# Altium schematic sheet USB_to_UART.SchDoc
size A3; ApprovedBy: Mustafa Atılay Beycan; CheckedBy: Mustafa Atılay Beycan; Author: Mustafa Atılay Beycan; CompanyName: Mustafa Atılay Beycan; DrawnBy: Mustafa Atılay Beycan; Engineer: Mustafa Atılay Beycan; Organization: Mustafa Atılay Beycan; SheetNumber: 5; SheetTotal: 8; FilePath: https://github.com/mustafaatilay/Outdoor-Tracking-Project
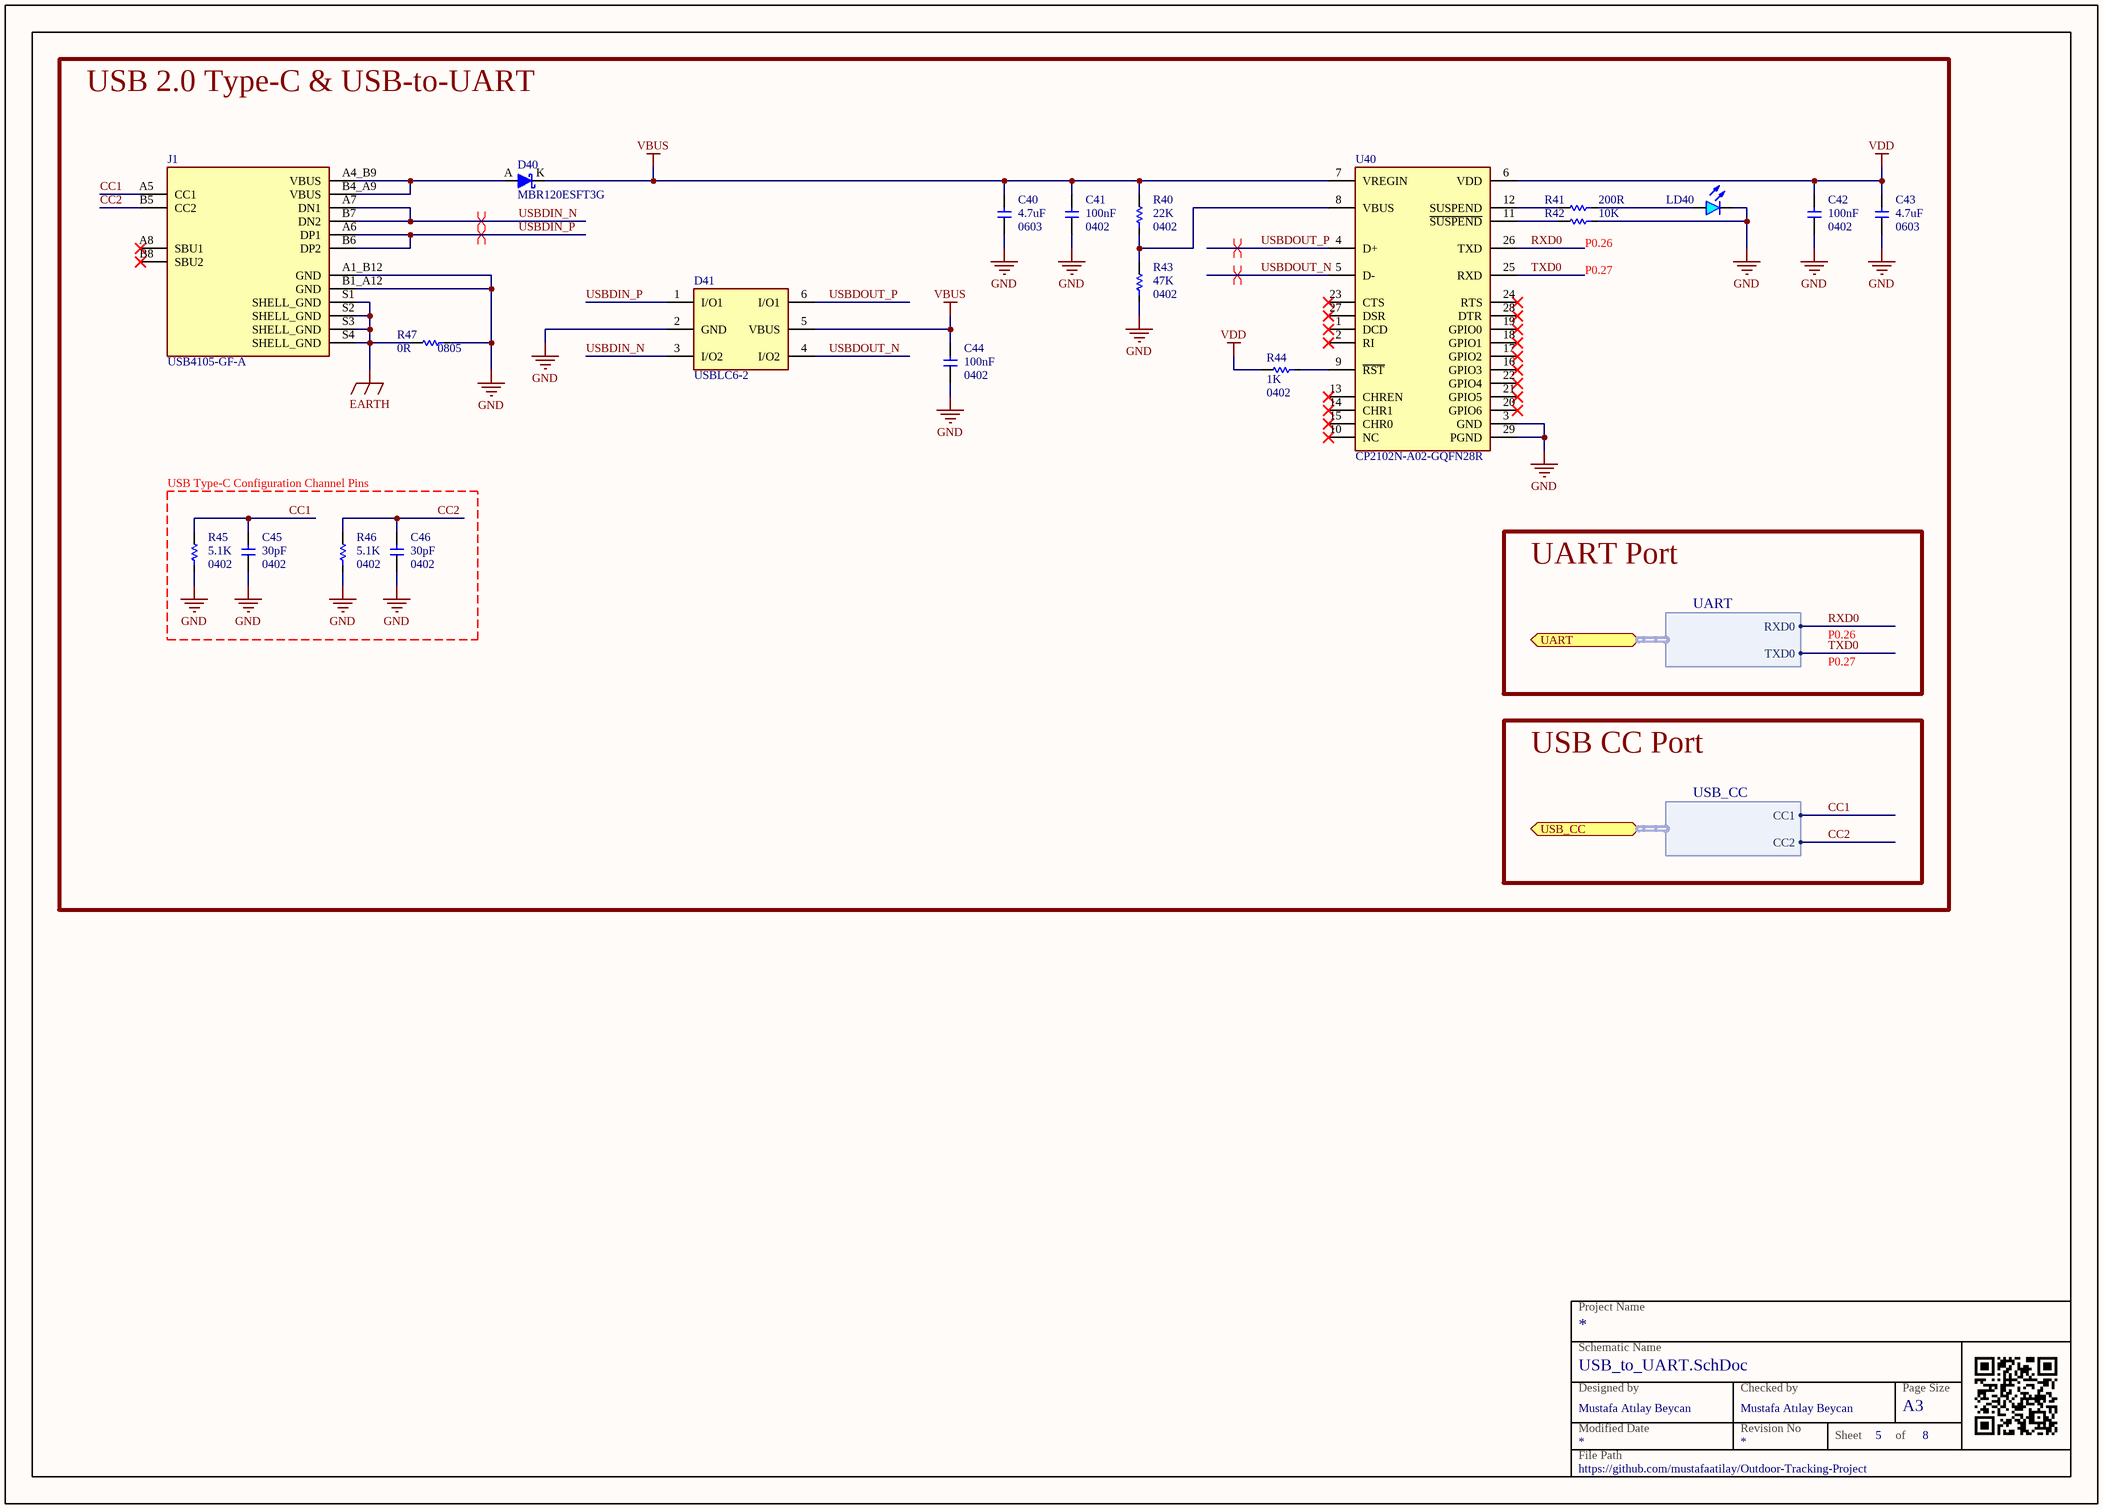
[diagram p0: USB_to_UART.SchDoc]

## Parts
C40  Capacitance: 4.7uF  Package: 0603  [CAP 0603]  (hidden comment: 4.7uF 10% X7R 16V 0603 SMD)
C41  Capacitance: 100nF  Package: 0402  [CAP 0402]  (hidden comment: 100nF 10% X7R 10V 0402 SMD)
C42  Capacitance: 100nF  Package: 0402  [CAP 0402]  (hidden comment: 100nF 10% X7R 10V 0402 SMD)
C43  Capacitance: 4.7uF  Package: 0603  [CAP 0603]  (hidden comment: 4.7uF 10% X7R 16V 0603 SMD)
C44  Capacitance: 100nF  Package: 0402  [CAP 0402]  (hidden comment: 100nF 10% X7R 16V 0402 SMD)
C45  Capacitance: 30pF  Package: 0402  [CAP 0402]  (hidden comment: 30pF 5% C0G/NP0 50V 0402 SMD)
C46  Capacitance: 30pF  Package: 0402  [CAP 0402]  (hidden comment: 30pF 5% C0G/NP0 50V 0402 SMD)
D40  MBR120ESFT3G  [DIODE SOD-123]
D41  USBLC6-2  [IC SOT23-6]
J1  USB4105-GF-A  [CONN USB TYPE-C USB4105-GF-A]
LD40  LED SMD  [LED 0603 BLUE]  (value not drawn)
R40  Resistance: 22K  Package: 0402  [RES 0402]  (hidden comment: 22K 1% 1/10W 0402 SMD)
R41  Resistance: 200R  [RES 0402]  (hidden comment: 200R 5% 1/10W 0402 SMD)
R42  Resistance: 10K  [RES 0402]  (hidden comment: 10K 5% 1/10W 0402 SMD)
R43  Resistance: 47K  Package: 0402  [RES 0402]  (hidden comment: 47K 1% 1/10W 0402 SMD)
R44  Resistance: 1K  Package: 0402  [RES 0402]  (hidden comment: 1K 5% 1/10W 0402 SMD)
R45  Resistance: 5.1K  Package: 0402  [RES 0402]  (hidden comment: RES 0402)
R46  Resistance: 5.1K  Package: 0402  [RES 0402]  (hidden comment: RES 0402)
R47  Resistance: 0R  Package: 0805  [RES 0805]  (hidden comment: 0R 5% * 0805 SMD)
U40  CP2102N-A02-GQFN28R  [IC QFN-28 (5x5)]

## Blocks framed on the sheet
USB Type-C Configuration Channel Pins: C45 C46 R45 R46

## Ports
UART (bidir, harness UART), USB_CC (bidir, harness USB_CC)

## Harnesses
UART: RXD0, TXD0
USB_CC: CC1, CC2

## Nets
EARTH: J1.S1(SHELL_GND) J1.S2(SHELL_GND) J1.S3(SHELL_GND) J1.S4(SHELL_GND) R47.2
GND: C40.2 C41.2 C42.2 C43.2 C44.2 C45.2 C46.2 D41.2(GND) J1.A1_B12(GND) J1.B1_A12(GND) LD40.K R42.1 R43.1 R45.1 R46.1 R47.1 U40.3(GND) U40.29(PGND)
VBUS: C40.1 C41.1 C44.1 D40.K D41.5(VBUS) R40.2 U40.7(VREGIN)
VDD: C42.1 C43.1 R44.2 U40.6(VDD)
CC1: C45.1 J1.A5(CC1) R45.2 ; port USB_CC.CC1
CC2: C46.1 J1.B5(CC2) R46.2 ; port USB_CC.CC2
RXD0: U40.26(TXD) ; port UART.RXD0
TXD0: U40.25(RXD) ; port UART.TXD0
USBDIN_N: D41.3(I/O2) J1.A7(DN1) J1.B7(DN2)
USBDIN_P: D41.1(I/O1) J1.A6(DP1) J1.B6(DP2)
USBDOUT_N: D41.4(I/O2) U40.5(D-)
USBDOUT_P: D41.6(I/O1) U40.4(D+)
NetD40_A: D40.A J1.A4_B9(VBUS) J1.B4_A9(VBUS)
NetLD40_A: LD40.A R41.1
NetR40_1: R40.1 R43.2 U40.8(VBUS)
NetR41_2: R41.2 U40.12(SUSPEND)
NetR42_2: R42.2 U40.11(~{SUSPEND})
NetR44_1: R44.1 U40.9(~{RST})

Not connected (* = marked no-connect by the designer): J1 A8(SBU1)* B8(SBU2)*; U40 1(DCD)* 2(RI)* 10(NC)* 13(CHREN)* 14(CHR1)* 15(CHR0)* 16(GPIO3)* 17(GPIO2)* 18(GPIO1)* 19(GPIO0)* 20(GPIO6)* 21(GPIO5)* 22(GPIO4)* 23(CTS)* 24(RTS)* 27(DSR)* 28(DTR)*

## Layout directives
differential pair: USBDIN_N, USBDIN_P, USBDOUT_N, USBDOUT_P

## Notes on the sheet
- USB 2.0 Type-C & USB-to-UART
- (near R42) P0.26
- P0.27
- UART Port
- P0.26
- USB CC Port
- Project Name
- Designed by
- Schematic Name
- Checked by
- Page Size
- File Path
- Modified Date
- Revision No
- Sheet
- of
- A3

## Library data of the parts
C40 C43 = CAP 0603 4.7uF 16V: ALT MALZEME KODU: 1.009.01147; Link: *; Manufacturer: *; Manufacturer Part Number: *; Value: 4.7uF 10% X7R 16V 0603 SMD; Tolerance: 10%; TemperatureCoefficient: X7R; Mount: SMD; Voltage: 16V
C41 C42 = CAP 0402 100nF 10V: ALT MALZEME KODU: 1.009.00840; Link: *; Manufacturer: *; Manufacturer Part Number: *; Value: 100nF 10% X7R 10V 0402 SMD; Tolerance: 10%; TemperatureCoefficient: X7R; Mount: SMD; Voltage: 10V
C44 = CAP 0402 100nF 16V: ALT MALZEME KODU: 1.009.00275; Link: *; Manufacturer: *; Manufacturer Part Number: *; Value: 100nF 10% X7R 16V 0402 SMD; Tolerance: 10%; TemperatureCoefficient: X7R; Mount: SMD; Voltage: 16V
C45 C46 = CAP 0402 30pF 50V: Link: *; Manufacturer: *; Manufacturer Part Number: *; Value: 30pF 5% C0G/NP0 50V 0402 SMD; Tolerance: 5%; TemperatureCoefficient: C0G/NP0; Mount: SMD; ALT MALZEME KODU: *; Voltage: 50V
D40 = DIODE MBR120ESFT3G: DIODE SCHOTTKY 20V 1A SOD123FL; Manufacturer: ON Semiconductor; Voltage - Forward: 530mV @ 1A; ALT MALZEME KODU: 1.012.00347; Link: https://bit.ly/37E0dBG; Manufacturer Part Number: MBR120ESFT3G; Mount: SMD; Current-Rectified: 1A; Package: SOD-123; Voltage - DC Reverse: 20V
D41 = DIODE USBLC6-2 TVS: TVS DIODE 5.25VWM 17VC SOT23-6; Manufacturer: STMicroelectronics; Manufacturer Part Number: USBLC6-2SC6; Direction: Unidirectional,Bidirectional; Clamping Voltage: 17V; Number of Bidirectional Channels: 2; Reverse Standoff Voltage: 5.25V; Min Breakdown Voltage: 6V; Power Line Protection: Yes; Leakage Current: 150nA; Peak Pulse Current: 5A; Capacitance: 3.5pF; Operating Supply Voltage: 1.1V; Working Voltage: 5V; Test Current: 1mA; Number of Elements: 1; Element Configuration: Dual; Data Rate: 480Mbps; Link: https://bit.ly/3zN9Iyf; Link 2: https://bit.ly/3tGO0rO; ALT MALZEME KODU: *; Supplier 1: Digi-Key; RoHS: Yes; Category: TVS Diodes; Pricing 1: 1=0,63000, 10=0,54200, 100=0,40440, 500=0,31774, 1000=0,24553 (USD); Mount: Surface Mount; Case/Package: SOT-23; Number of Pins: 6; Contact Plating: Tin,Matte; Min Operating Temperature: -40°C; Max Operating Temperature: 125°C; Packaging: Tape and Reel; Series: USB; Package Quantity: 3000; Breakdown Voltage: 6V; Number of Channels: 2; Polarity: Unidirectional,Bidirectional; Termination: SMD/SMT; ESD Protection: Yes; Max Reverse Leakage Current: 150nA; Reverse Breakdown Voltage: 6V; Max Breakdown Voltage: 6V; Clamping Voltage-Max: 17V; Length: 3.05mm; Width: 1.75mm; Height: 1.3mm; Depth: 1.75mm; Radiation Hardening: No; RoHS Compliant: Yes; Lead Free: Lead Free; REACH SVHC: No SVHC; ComponentLink1URL: https://datasheet.ciiva.com/1268/1690354-1268384.pdf?src-supplier=Element14; ComponentLink1Description: https://datasheet.ciiva.com/1268/1690354-1268384.pdf?src-supplier=Element14; ComponentLink2URL: https://datasheet.ciiva.com/4508/cd00050750-113117-4508433.pdf?src-supplier=Mouser; ComponentLink2Description: https://datasheet.ciiva.com/4508/cd00050750-113117-4508433.pdf?src-supplier=Mouser; ComponentLink3URL: https://datasheet.ciiva.com/15143/getdatasheetpartid-148465-15143789.pdf?src-supplier=Verical; ComponentLink3Description: https://datasheet.ciiva.com/15143/getdatasheetpartid-148465-15143789.pdf?src-supplier=Verical; ComponentLink4URL: https://datasheet.ciiva.com/16200/cd00050750-16200026.pdf?src-supplier=Future+Electronics; ComponentLink4Description: https://datasheet.ciiva.com/16200/cd00050750-16200026.pdf?src-supplier=Future+Electronics; ComponentLink5URL: https://datasheet.ciiva.com/41444/001184109-da-01-en-ic-esd-protecti-usblc6-2sc6-sot-23-6-stm-41444156.pdf?src-supplier=Conrad; ComponentLink5Description: https://datasheet.ciiva.com/41444/001184109-da-01-en-ic-esd-protecti-usblc6-2sc6-sot-23-6-stm-41444156.pdf?src-supplier=Conrad; Supplier Part Number 1: 497-5235-6-ND
J1 = CONN USB TYPE-C USB4105-GF-A: CONN RCP USB2.0 TYP C 24P SMD RA; ALT MALZEME KODU: 1.010.01014; MF: {'manufacturer': u'GCT'}; Link: https://bit.ly/3MQbJhe; MP: USB4105-GF-A; Value: *; Price: None
LD40 = LED SMD BLUE_0603: LED SMD 0603 BLUE; Link: *; ALT MALZEME KODU: *; Color: BLUE; Package: 0603
R40 = RES 0402 22K 1%: ALT MALZEME KODU: 1.031.00871; Link: *; Manufacturer: *; Manufacturer Part Number: *; Value: 22K 1% 1/10W 0402 SMD; Tolerance: 1%; PowerRating: 1/10W; Mount: SMD
R41 = RES 0402 200R 5%: ALT MALZEME KODU: 1.031.00643; Link: *; Manufacturer: *; Manufacturer Part Number: *; Value: 200R 5% 1/10W 0402 SMD; PowerRating: 1/10W; Mount: SMD; Tolerance: 5%; Package: 0402
R42 = RES 0402 10K 5%: ALT MALZEME KODU: 1.031.00615; Link: *; Manufacturer: *; Manufacturer Part Number: *; Value: 10K 5% 1/10W 0402 SMD; Tolerance: 5%; PowerRating: 1/10W; Mount: SMD; Package: 0402
R43 = RES 0402 47K 1%: ALT MALZEME KODU: 1.031.00696; Link: *; Manufacturer: *; Manufacturer Part Number: *; Value: 47K 1% 1/10W 0402 SMD; PowerRating: 1/10W; Mount: SMD; Tolerance: 1%
R44 = RES 0402 1K 5%: ALT MALZEME KODU: 1.031.00622; Link: *; Manufacturer: *; Manufacturer Part Number: *; Value: 1K 5% 1/10W 0402 SMD; PowerRating: 1/10W; Mount: SMD; Tolerance: 5%
R45 R46 = RES 0402: Tolerance: 10%; PowerRating: 1/10W; Link: *; Manufacturer: *; Manufacturer Part Number: *; Value: RES 0402; Mount: SMD; ALT MALZEME KODU: *
R47 = RES 0805 0R 5%: ALT MALZEME KODU: 1.031.00613; Link: *; Manufacturer: *; Manufacturer Part Number: *; Value: 0R 5% * 0805 SMD; Tolerance: 5%; PowerRating: *; Mount: SMD
U40 = IC CP2102N-A02-GQFN28R: IC USB TO UART BRIDGE QFN28; Manufacturer: Silicon Labs; Protocol: USB 2.0; Voltage - Supply: 3.3V ~ 5.25V; Current - Supply: 15mA; ALT MALZEME KODU: 1.020.01045; Manufacturer Part Number: CP2102N-A02-GQFN28R; Link: https://bit.ly/2YGeVUM; Interface: UART; Mount: SMD; Package: 28-SSOP